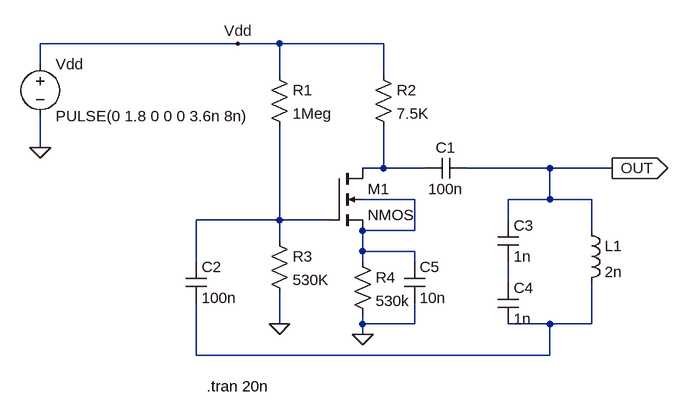
[diagram p0: schematic colpitt_osc.asc]
colpitt_osc.asc, the LTspice schematic file:
Version 4
SHEET 1 880 680
WIRE 80 16 -224 16
WIRE 144 16 80 16
WIRE 304 16 144 16
WIRE -224 48 -224 16
WIRE 144 64 144 16
WIRE 304 64 304 16
WIRE -224 176 -224 128
WIRE 304 208 304 144
WIRE 304 208 272 208
WIRE 368 208 304 208
WIRE 560 208 432 208
WIRE 656 208 560 208
WIRE 352 256 272 256
WIRE 560 256 560 208
WIRE 560 256 496 256
WIRE 624 256 560 256
WIRE 144 288 144 144
WIRE 144 288 16 288
WIRE 224 288 144 288
WIRE 496 288 496 256
WIRE 352 304 352 256
WIRE 352 304 272 304
WIRE 624 304 624 256
WIRE 144 320 144 288
WIRE 272 336 272 304
WIRE 352 336 272 336
WIRE 16 352 16 288
WIRE 272 352 272 336
WIRE 352 352 352 336
WIRE 496 384 496 352
WIRE 144 448 144 400
WIRE 272 448 272 432
WIRE 352 448 352 416
WIRE 352 448 272 448
WIRE 560 448 496 448
WIRE 624 448 624 384
WIRE 624 448 560 448
WIRE 272 464 272 448
WIRE 16 496 16 416
WIRE 560 496 560 448
WIRE 560 496 16 496
FLAG -224 176 0
FLAG 656 208 OUT
IOPIN 656 208 Out
FLAG 144 448 0
FLAG 272 464 0
FLAG 80 16 Vdd
SYMBOL voltage -224 32 R0
WINDOW 123 0 0 Left 0
WINDOW 39 0 0 Left 0
SYMATTR InstName Vdd
SYMATTR Value PULSE(0 1.8 0 0 0 3.6n 8n)
SYMBOL res 128 48 R0
SYMATTR InstName R1
SYMATTR Value 1Meg
SYMBOL res 288 48 R0
SYMATTR InstName R2
SYMATTR Value 7.5K
SYMBOL cap 432 192 R90
WINDOW 0 0 32 VBottom 2
WINDOW 3 32 32 VTop 2
SYMATTR InstName C1
SYMATTR Value 100n
SYMBOL nmos4 224 208 R0
SYMATTR InstName M1
SYMATTR Value2 l=180n w=360n
SYMBOL res 128 304 R0
SYMATTR InstName R3
SYMATTR Value 530K
SYMBOL cap 0 352 R0
SYMATTR InstName C2
SYMATTR Value 100n
SYMBOL ind 608 288 R0
SYMATTR InstName L1
SYMATTR Value 2n
SYMBOL cap 480 288 R0
SYMATTR InstName C3
SYMATTR Value 1n
SYMBOL cap 480 384 R0
SYMATTR InstName C4
SYMATTR Value 1n
SYMBOL res 256 336 R0
SYMATTR InstName R4
SYMATTR Value 530k
SYMBOL cap 336 352 R0
SYMATTR InstName C5
SYMATTR Value 10n
TEXT 32 544 Left 2 !.tran 20n

The netlist it stands for:
* colpitt_osc.asc
Vdd Vdd 0 PULSE(0 1.8 0 0 0 3.6n 8n)
R1 Vdd N003 1Meg
R2 Vdd N001 7.5K
C1 OUT N001 100n
M1 N001 N003 N002 N002 NMOS l=180n w=360n
R3 N003 0 530K
C2 N003 N005 100n
L1 OUT N005 2n
C3 OUT N004 1n
C4 N004 N005 1n
R4 N002 0 530k
C5 N002 0 10n
.model NMOS NMOS
.model PMOS PMOS
.lib standard.mos
.tran 20n
.backanno
.end